# EAGLE board ADCS Motherboard (EAGLE 9.6.2)
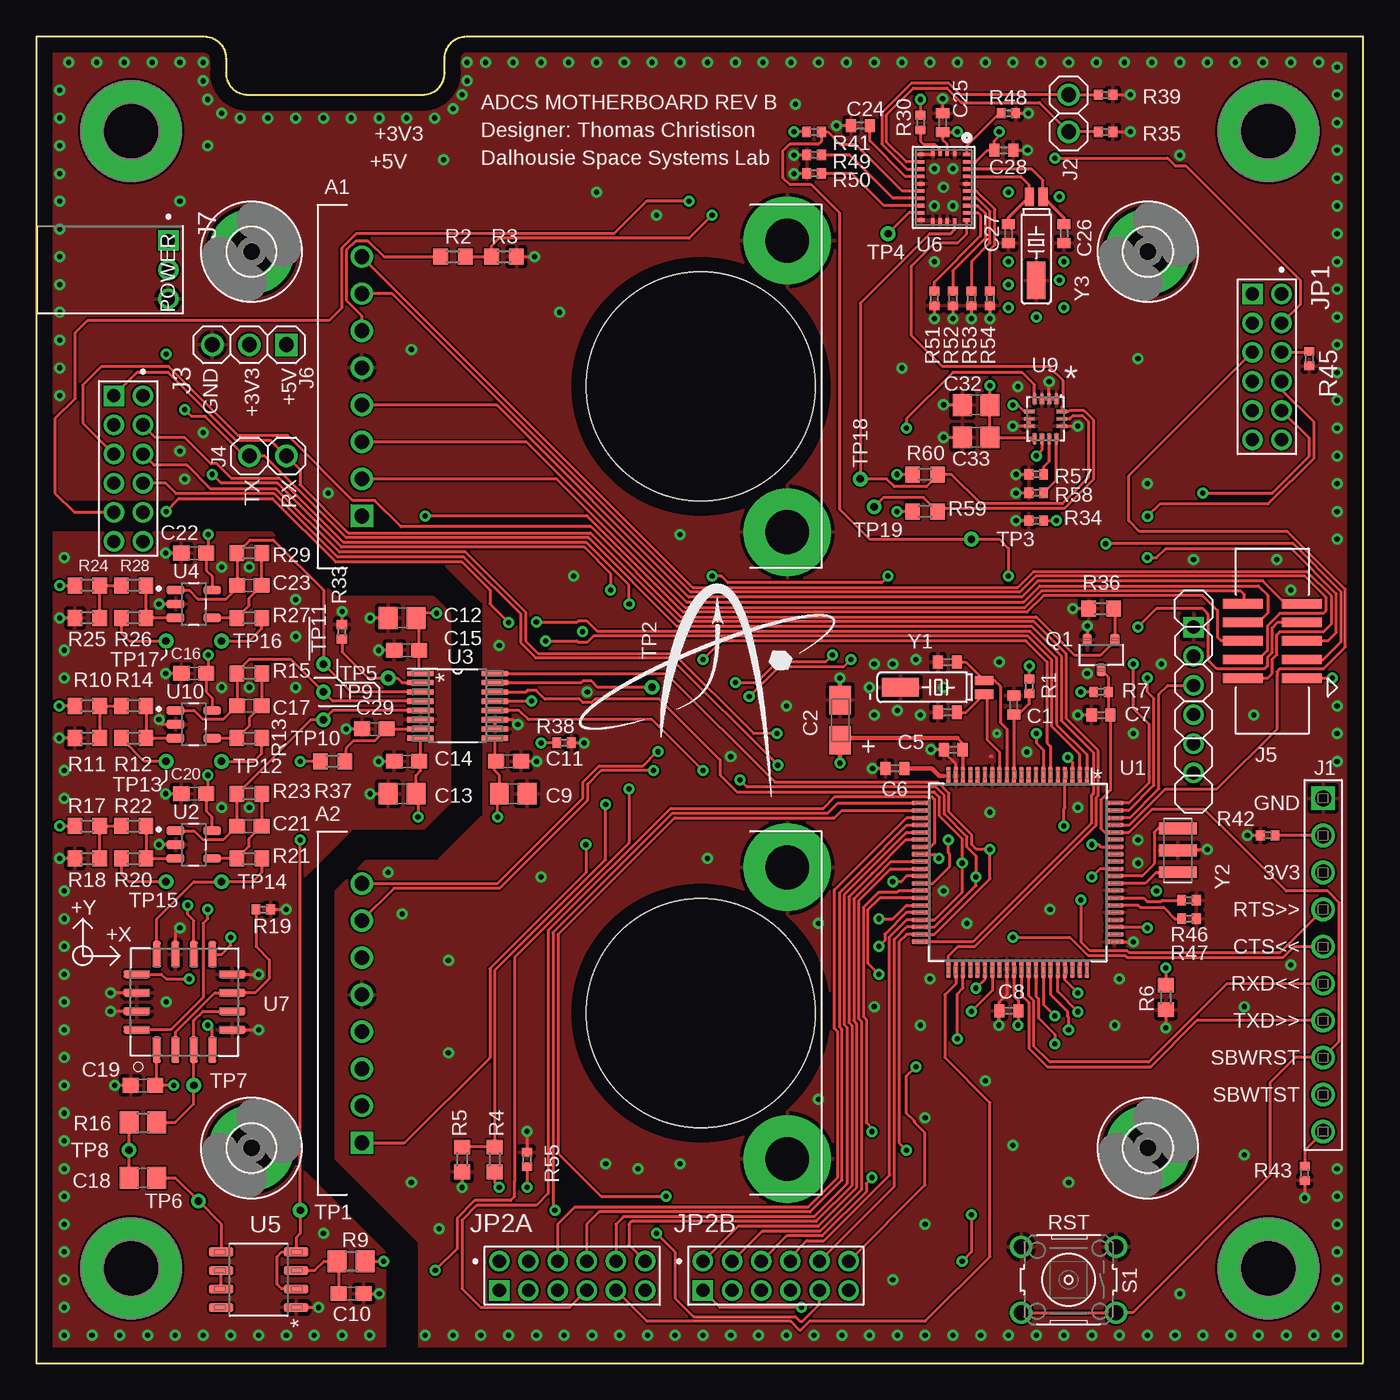
[diagram p4: board, top side]
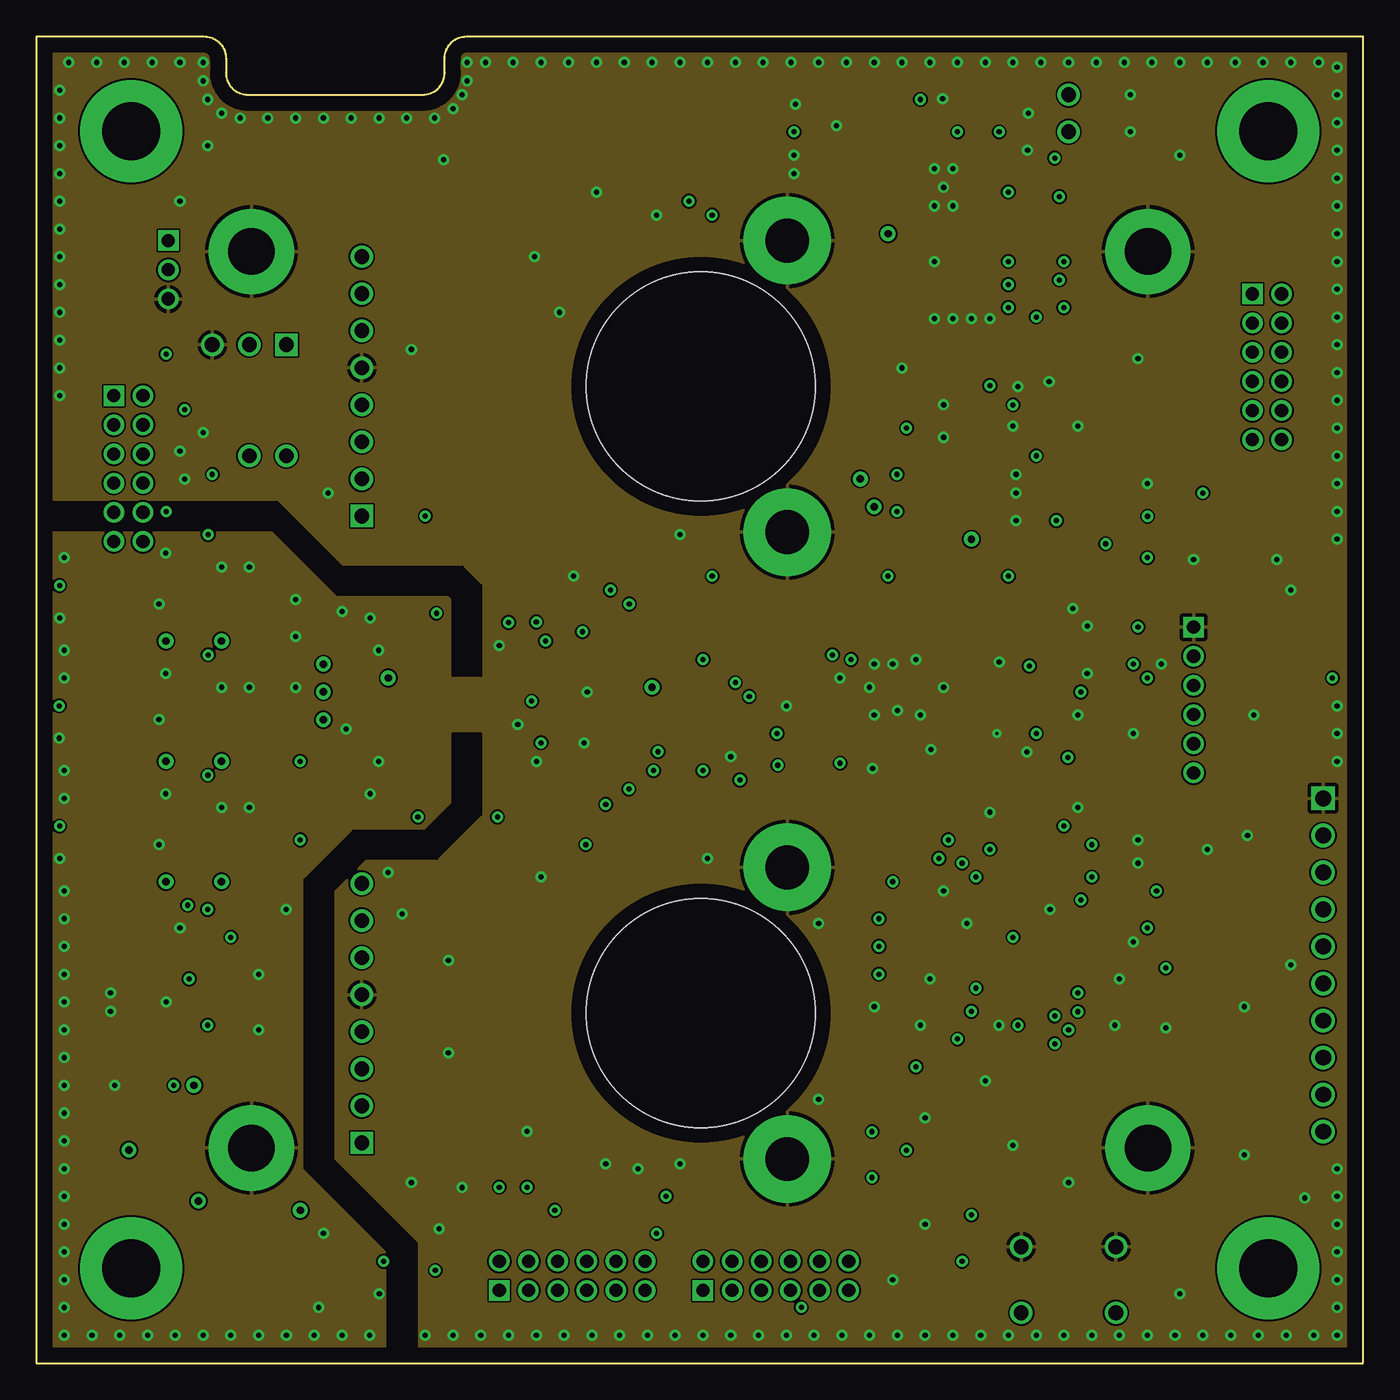
[diagram p5: board, inner layer GND]
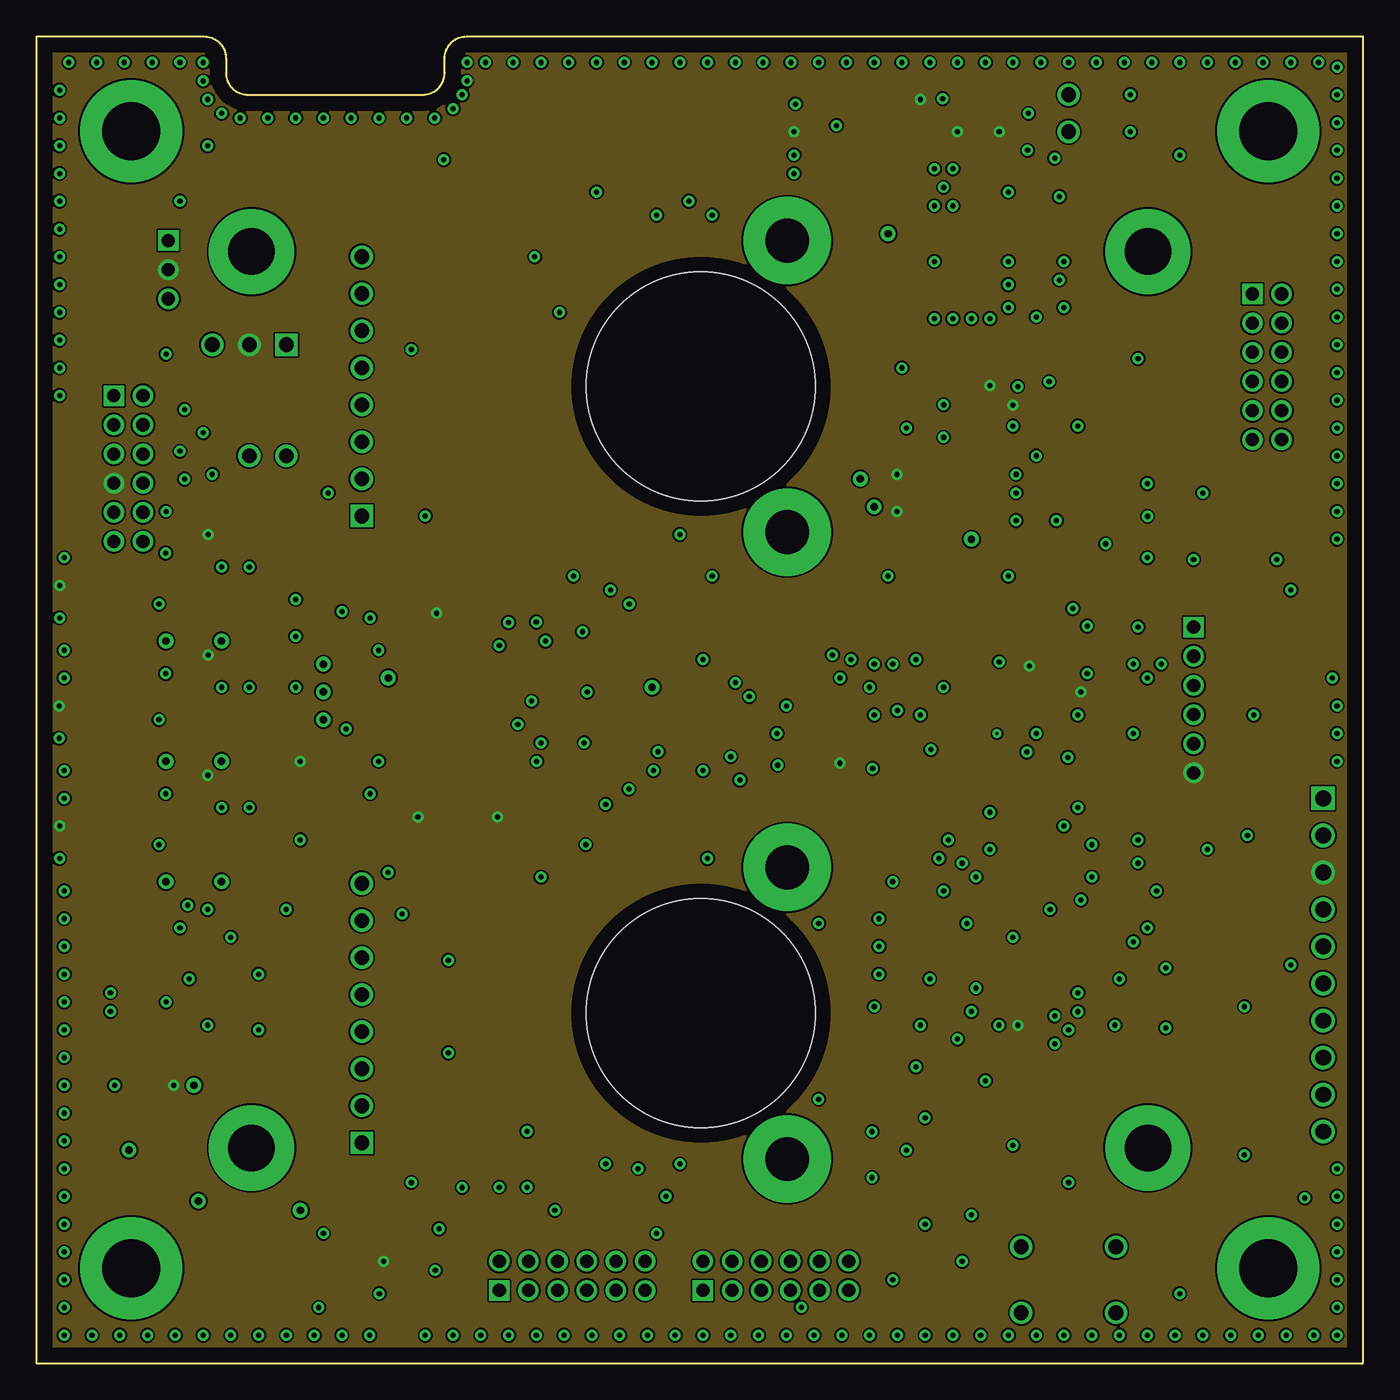
[diagram p6: board, inner layer PWR]
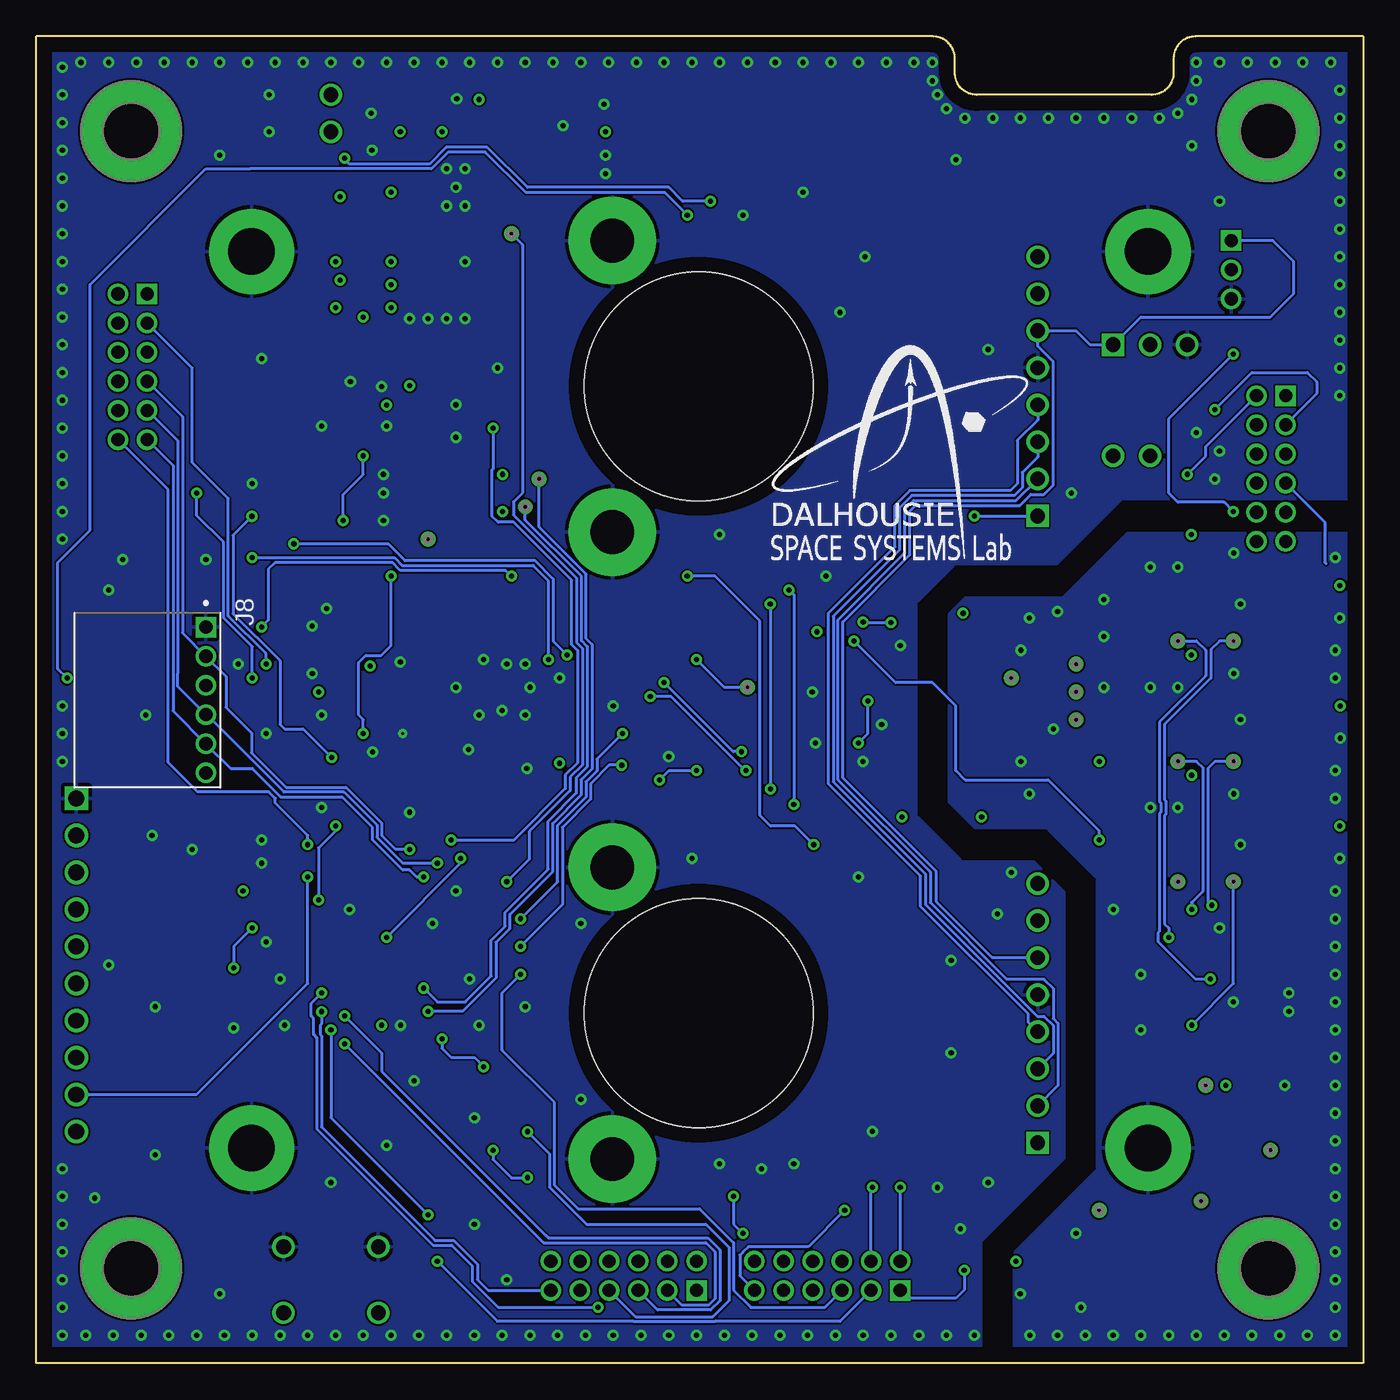
[diagram p7: board, bottom side, seen from below]

Size 91 x 91 mm. Coordinates in mm from the lower left corner, seen from the top.
Outline: 0,0 91,0 91,91 29.5,91 arc90 28,89.5 28,88.5 arc-90 26.5,87 14.5,87 arc-90 13,88.5 13,89.5 arc90 11.5,91 0,91 0,0
Copper layers (1+2*15+16): Top 0.035mm / dielectric 0.2mm / GND 0.035mm / dielectric 1.03mm / PWR 0.035mm / dielectric 0.2mm / Bottom 0.035mm
Design rules "default *": minimum track width 6mil, minimum drill 0.2mm, track to track 5mil, track to pad 0.2mm, pad to pad 5mil, via to via 0.54mm, smd to smd 6mil, copper to edge 40mil, drill to drill 0.54mm, minimum pad ring 10mil, minimum via ring 8mil, stop-mask expansion 4mil, vias tented up to drill 0mil, thermal gap 10mil
Net classes: 1 Ground: width 0.203 mm, drill 0.305 mm, clearance 0.152 mm to class 0, clearance 0.152 mm; 2 Power: width 0.203 mm, drill 0.305 mm, clearance 0.152 mm to class 0, clearance 0.152 mm to class 1, clearance 0.152 mm

## Footprints (pad centres in the part's own frame; a part is rotated, then mirrored left to right if it is on the bottom)
ARDUCAM = drill 1.016 square: 1 -29.18,-18.89 | drill 1.016: 2 -29.18,-16.35; 3 -29.18,-13.81; 4 -29.18,-11.27; 5 -29.18,-8.73; 6 -29.18,-6.19; 7 -29.18,-3.65; 8 -29.18,-1.11 | drill 3 pad 6: P$1 0,0; P$2 0,-20 | hole 15.7: -5.917,-10
C0402 = smd 0.7 x 0.9: 1 -0.65,0; 2 0.65,0
A/3216-18R = smd 1.95 x 1.5: + 1.375,0; - -1.375,0
C0805 = smd 1.3 x 1.5: 1 -0.95,0; 2 0.95,0
C0603 = smd 1.1 x 1: 1 -0.85,0; 2 0.85,0
3,2-PAD = drill 3.2 pad 5.842: B3,2 0,0
HDRV10W66P254_10X1_2540X254H858 = drill 1.08 pad 1.62 square: 1 0,0 | drill 1.08 pad 1.62: 2 2.54,0; 3 5.08,0; 4 7.62,0; 5 10.16,0; 6 12.7,0; 7 15.24,0; 8 17.78,0; 9 20.32,0; 10 22.86,0
1X02 = drill 1.016: 1 -1.27,0; 2 1.27,0
832-10-012-10-005000 = drill 0.9 pad 1.25 square: 1 0,-2 | drill 0.9 pad 1.25: 2 0,0; 3 2,-2; 4 2,0; 5 4,-2; 6 4,0; 7 6,-2; 8 6,0; 9 8,-2; 10 8,0; 11 10,-2; 12 10,0
CNC_3221-10-0300-00 = smd 0.65 x 2.76: 1 -2.54,-2.02; 2 -2.54,2.02; 3 -1.27,-2.02; 4 -1.27,2.02; 5 0,-2.02; 6 0,2.02; 7 1.27,-2.02; 8 1.27,2.02; 9 2.54,-2.02; 10 2.54,2.02
1X03 = drill 1.016 square: 1 -2.54,0 | drill 1.016: 2 0,0; 3 2.54,0
830-10-003-20-005000 = drill 0.9 pad 1.25 square: 1 0,0 | drill 0.9 pad 1.25: 2 2,0; 3 4,0
830-10-006-20-005000 = drill 0.9 pad 1.25 square: 1 0,0 | drill 0.9 pad 1.25: 2 2,0; 3 4,0; 4 6,0; 5 8,0; 6 10,0
MTGP700H400 = drill 4 pad 7: 1 0,0
SOT23-3P95_230X110L20X43N_PMV16XN = smd 0.61 x 0.87: 1 -0.95,-1.02; 2 0.95,-1.02; 3 0,1.02
R0402 = smd 0.6 x 0.7: 1 -0.5,0; 2 0.5,0
R0603 = smd 1 x 1.1: 1 -0.85,0; 2 0.85,0
R0805 = smd 1.3 x 1.5: 1 -0.95,0; 2 0.95,0
B3F-10XX = drill 1.016: 1 -3.251,2.261; 2 3.251,2.261; 3 -3.251,-2.261; 4 3.251,-2.261
TP_P76H50 = drill 0.51 pad 0.762: 1 0,0
QFP80P50_1400X1400X160L60X22N = smd 0.3 x 1.26: 1 -4.75,-6.63; 2 -4.25,-6.63; 3 -3.75,-6.63; 4 -3.25,-6.63; 5 -2.75,-6.63; 6 -2.25,-6.63; 7 -1.75,-6.63; 8 -1.25,-6.63; 9 -0.75,-6.63; 10 -0.25,-6.63; 11 0.25,-6.63; 12 0.75,-6.63; 13 1.25,-6.63; 14 1.75,-6.63; 15 2.25,-6.63; 16 2.75,-6.63; 17 3.25,-6.63; 18 3.75,-6.63; 19 4.25,-6.63; 20 4.75,-6.63; 41 4.75,6.63; 42 4.25,6.63; 43 3.75,6.63; 44 3.25,6.63; 45 2.75,6.63; 46 2.25,6.63; 47 1.75,6.63; 48 1.25,6.63; 49 0.75,6.63; 50 0.25,6.63; 51 -0.25,6.63; 52 -0.75,6.63; 53 -1.25,6.63; 54 -1.75,6.63; 55 -2.25,6.63; 56 -2.75,6.63; 57 -3.25,6.63; 58 -3.75,6.63; 59 -4.25,6.63; 60 -4.75,6.63 | smd 1.26 x 0.3: 21 6.63,-4.75; 22 6.63,-4.25; 23 6.63,-3.75; 24 6.63,-3.25; 25 6.63,-2.75; 26 6.63,-2.25; 27 6.63,-1.75; 28 6.63,-1.25; 29 6.63,-0.75; 30 6.63,-0.25; 31 6.63,0.25; 32 6.63,0.75; 33 6.63,1.25; 34 6.63,1.75; 35 6.63,2.25; 36 6.63,2.75; 37 6.63,3.25; 38 6.63,3.75; 39 6.63,4.25; 40 6.63,4.75; 61 -6.63,4.75; 62 -6.63,4.25; 63 -6.63,3.75; 64 -6.63,3.25; 65 -6.63,2.75; 66 -6.63,2.25; 67 -6.63,1.75; 68 -6.63,1.25; 69 -6.63,0.75; 70 -6.63,0.25; 71 -6.63,-0.25; 72 -6.63,-0.75; 73 -6.63,-1.25; 74 -6.63,-1.75; 75 -6.63,-2.25; 76 -6.63,-2.75; 77 -6.63,-3.25; 78 -6.63,-3.75; 79 -6.63,-4.25; 80 -6.63,-4.75
SOT95P280X145-5N = smd 1.21 x 0.59: 1 -1.255,0.95; 2 -1.255,0; 3 -1.255,-0.95; 4 1.255,-0.95; 5 1.255,0.95
DBQ16 = smd 1.803 x 0.356: 1 -2.553,2.223; 2 -2.553,1.587; 3 -2.553,0.953; 4 -2.553,0.318; 5 -2.553,-0.318; 6 -2.553,-0.953; 7 -2.553,-1.587; 8 -2.553,-2.223; 9 2.553,-2.223; 10 2.553,-1.587; 11 2.553,-0.953; 12 2.553,-0.318; 13 2.553,0.318; 14 2.553,0.953; 15 2.553,1.587; 16 2.553,2.223
SOIC8P127_490X600X175L72X40N_DMC4050SSDQ-13 = smd 0.65 x 1.68: 1 -1.905,-2.575; 2 -0.635,-2.575; 3 0.635,-2.575; 4 1.905,-2.575; 5 1.905,2.575; 6 0.635,2.575; 7 -0.635,2.575; 8 -1.905,2.575
BNO055 = smd 0.25 x 0.475: 1 -2.25,1.562; 6 -2.25,-1.562; 7 -1.75,-1.562; 8 -1.25,-1.562; 9 -0.75,-1.562; 10 -0.25,-1.562; 11 0.25,-1.562; 12 0.75,-1.562; 13 1.25,-1.562; 14 1.75,-1.562; 15 2.25,-1.562; 20 2.25,1.562; 21 1.75,1.562; 22 1.25,1.562; 23 0.75,1.562; 24 0.25,1.562; 25 -0.25,1.562; 26 -0.75,1.562; 27 -1.25,1.562; 28 -1.75,1.562 | smd 0.375 x 0.25: 2 -2.312,0.75; 3 -2.312,0.25; 4 -2.312,-0.25; 5 -2.312,-0.75; 16 2.312,-0.75; 17 2.312,-0.25; 18 2.312,0.25; 19 2.312,0.75
LCCS16P127_736X736X279L127X50N = smd 0.56 x 1.83: 1 -1.905,-3.275; 2 -0.635,-3.275; 3 0.635,-3.275; 4 1.905,-3.275; 9 1.905,3.275; 10 0.635,3.275; 11 -0.635,3.275; 12 -1.905,3.275 | smd 1.83 x 0.56: 5 3.275,-1.905; 6 3.275,-0.635; 7 3.275,0.635; 8 3.275,1.905; 13 -3.275,1.905; 14 -3.275,0.635; 15 -3.275,-0.635; 16 -3.275,-1.905
QFN14P50_300X250X100L47X25N = smd 0.79 x 0.27: 1 -1.365,0.75; 2 -1.365,0.25; 3 -1.365,-0.25; 4 -1.365,-0.75; 8 1.365,-0.75; 9 1.365,-0.25; 10 1.365,0.25; 11 1.365,0.75 | smd 0.27 x 0.79: 5 -0.5,-1.115; 6 0,-1.115; 7 0.5,-1.115; 12 0.5,1.115; 13 0,1.115; 14 -0.5,1.115
MS3V-T1R = smd 0.635 x 1.27: P1 -0.47,-4.43; P2 0.47,-4.43 | smd 1.27 x 2.54: P3 0,1.3
MURATA-FILTER_CSTCR = smd 0.8 x 2.6: 1 -1.5,0; 2 0,0; 3 1.5,0

## Placement (x,y rotation side)
A1  ARDUCAM_OV5642  [ARDUCAM]  51.5,77 0 top
A2  ARDUCAM_OV5642  [ARDUCAM]  51.5,34 0 top
C1  100n  [C0402]  67.04,45.14 90 top
C2  10u  [A/3216-18R]  55.13,44.09 270 top
C3  12p  [C0402]  62.5,48.08 0 top
C4  12p  [C0402]  62.5,44.64 0 top
C5  100n  [C0402]  62.89,42.08 0 top
C6  470n  [C0402]  58.89,40.79 0 top
C7  1n  [C0402]  73.03,44.45 180 top
C8  100n  [C0402]  66.71,24.17 180 top
C9  1u  [C0805]  32.7,39.05 0 top
C10  1u  [C0603]  21.59,4.76 180 top
C11  0.1u  [C0603]  32.38,41.27 0 top
C12  1u  [C0805]  25.08,51.12 180 top
C13  1u  [C0805]  25.08,39.05 180 top
C14  0.1u  [C0603]  25.4,41.27 180 top
C15  0.1u  [C0603]  25.4,48.9 180 top
C16  0.1u  [C0603]  10.79,47.31 180 top
C17  1n  [C0603]  14.61,45.09 180 top
C18  0.1u  [C0805]  7.3,12.7 180 top
C19  0.1u  [C0603]  7.3,19.05 180 top
C20  0.1u  [C0603]  10.79,39.05 180 top
C21  1n  [C0603]  14.61,36.83 180 top
C22  0.1u  [C0603]  10.79,55.56 180 top
C23  1n  [C0603]  14.61,53.34 180 top
C24  1u  [C0402]  56.52,84.89 0 top
C25  0.1u  [C0402]  62.16,85.09 270 top
C26  22p  [C0402]  70.48,77.47 90 top
C27  22p  [C0402]  66.67,77.47 90 top
C28  0.1u  [C0402]  66.36,83.19 180 top
C29  0.1u  [C0603]  23.18,43.5 180 top
C32  0.1uF  [C0805]  64.45,65.72 180 top
C33  0.1uF  [C0805]  64.45,63.5 180 top
H1  MOUNT-PAD-ROUND3.2  [3,2-PAD]  14.75,76.25 0 top
H2  MOUNT-PAD-ROUND3.2  [3,2-PAD]  76.25,76.25 0 top
H3  MOUNT-PAD-ROUND3.2  [3,2-PAD]  76.25,14.75 0 top
H4  MOUNT-PAD-ROUND3.2  [3,2-PAD]  14.75,14.75 0 top
J1  HDR_10_EZFET_DEBUGGER  [HDRV10W66P254_10X1_2540X254H858]  88.27,38.73 270 top
J2  [1X02]  70.8,85.72 90 top
J3  832-10-012-10-005000  [832-10-012-10-005000]  7.3,66.36 270 top
J4  [1X02]  15.88,62.23 0 top
J5  CNC_3221-10-0300-00  [CNC_3221-10-0300-00]  84.77,49.53 90 top
J6  [1X03]  14.61,69.85 180 top
J7  830-10-003-20-005000  [830-10-003-20-005000]  9.05,76.99 270 top
J8  830-10-006-20-005000  [830-10-006-20-005000]  79.38,50.48 270 bottom
JP1  832-10-012-10-005000  [832-10-012-10-005000]  85.41,73.34 270 top
JP2A  832-10-012-10-005000  [832-10-012-10-005000]  31.75,6.99 0 top
JP2B  832-10-012-10-005000  [832-10-012-10-005000]  45.72,6.99 0 top
MH1  MTGP700H400  [MTGP700H400]  6.5,6.5 0 top
MH2  MTGP700H400  [MTGP700H400]  84.5,6.5 0 top
MH3  MTGP700H400  [MTGP700H400]  84.5,84.5 0 top
MH4  MTGP700H400  [MTGP700H400]  6.5,84.5 0 top
Q1  BSR802NL6327HTSA1  [SOT23-3P95_230X110L20X43N_PMV16XN]  73.03,48.58 180 top
R1  0R  [R0402]  68.11,46.43 90 top
R2  1k  [R0603]  28.57,75.88 180 top
R3  2k  [R0603]  32.07,75.88 180 top
R4  1k  [R0603]  31.43,13.97 270 top
R5  2k  [R0603]  29.21,13.97 90 top
R6  1M  [R0603]  77.47,25.08 90 top
R7  47k  [R0402]  73.03,46.04 180 top
R9  200R  [R0805]  21.59,6.99 0 top
R10  1k  [R0603]  3.49,45.09 0 top
R11  1k  [R0603]  3.49,42.86 180 top
R12  5.6k  [R0603]  6.67,42.86 180 top
R13  5.6k  [R0603]  14.61,42.86 0 top
R14  1.37M  [R0603]  6.67,45.09 0 top
R15  1.37M  [R0603]  14.61,47.31 0 top
R16  1R  [R0805]  7.3,16.51 0 top
R17  1k  [R0603]  3.49,36.83 0 top
R18  1k  [R0603]  3.49,34.61 180 top
R19  5.1M  [R0402]  15.56,31.11 180 top
R20  5.6k  [R0603]  6.67,34.61 180 top
R21  5.6k  [R0603]  14.61,34.61 0 top
R22  1.37M  [R0603]  6.67,36.83 0 top
R23  1.37M  [R0603]  14.61,39.05 0 top
R24  1k  [R0603]  3.49,53.34 0 top
R25  1k  [R0603]  3.49,51.12 180 top
R26  5.6k  [R0603]  6.67,51.12 180 top
R27  5.6k  [R0603]  14.61,51.12 0 top
R28  1.37M  [R0603]  6.67,53.34 0 top
R29  1.37M  [R0603]  14.61,55.56 0 top
R30  10k  [R0402]  60.64,85.09 90 top
R33  5.1M  [R0402]  20.95,50.16 270 top
R34  5.1M  [R0402]  68.58,57.78 0 top
R35  5.1M  [R0402]  73.34,84.45 180 top
R36  10k  [R0603]  73.03,51.75 0 top
R37  10k  [R0603]  20.32,41.27 0 top
R38  5.1M  [R0402]  36.2,42.55 180 top
R39  5.1M  [R0402]  73.34,87 180 top
R41  10k  [R0402]  53.34,84.45 180 top
R42  5.1M  [R0402]  84.45,36.2 180 top
R43  5.1M  [R0402]  87,13.02 270 top
R45  5.1M  [R0402]  87.31,68.9 270 top
R46  5.1M  [R0402]  79.06,31.75 0 top
R47  5.1M  [R0402]  79.06,30.48 0 top
R48  5.1M  [R0402]  66.67,85.72 180 top
R49  5.1M  [R0402]  53.34,82.87 0 top
R50  5.1M  [R0402]  53.34,81.6 0 top
R51  5.1M  [R0402]  61.59,73.03 90 top
R52  5.1M  [R0402]  62.87,73.03 90 top
R53  5.1M  [R0402]  64.14,73.03 90 top
R54  5.1M  [R0402]  65.41,73.03 90 top
R55  5.1M  [R0402]  33.66,13.97 270 top
R57  5.1M  [R0402]  68.58,60.96 180 top
R58  5.1M  [R0402]  68.58,59.69 180 top
R59  4.7k  [R0603]  60.96,58.42 180 top
R60  4.7k  [R0603]  60.96,60.96 180 top
S1  RST  [B3F-10XX]  70.8,5.71 180 top
TP1  TESTPOINT  [TP_P76H50]  18.1,10.48 90 top
TP2  TESTPOINT  [TP_P76H50]  42.23,46.35 270 top
TP3  TESTPOINT  [TP_P76H50]  64.14,56.52 180 top
TP4  TESTPOINT  [TP_P76H50]  58.42,77.47 90 top
TP5  TESTPOINT  [TP_P76H50]  24.13,46.99 0 top
TP6  TESTPOINT  [TP_P76H50]  11.11,11.11 0 top
TP7  TESTPOINT  [TP_P76H50]  10.79,19.05 0 top
TP8  TESTPOINT  [TP_P76H50]  6.35,14.61 0 top
TP9  TESTPOINT  [TP_P76H50]  19.68,46.04 0 top
TP10  TESTPOINT  [TP_P76H50]  19.68,44.13 0 top
TP11  TESTPOINT  [TP_P76H50]  19.68,47.94 0 top
TP12  TESTPOINT  [TP_P76H50]  12.7,41.27 270 top
TP13  TESTPOINT  [TP_P76H50]  8.89,41.27 270 top
TP14  TESTPOINT  [TP_P76H50]  12.7,33.02 0 top
TP15  TESTPOINT  [TP_P76H50]  8.89,33.02 0 top
TP16  TESTPOINT  [TP_P76H50]  12.7,49.53 0 top
TP17  TESTPOINT  [TP_P76H50]  8.89,49.53 0 top
TP18  TESTPOINT  [TP_P76H50]  56.52,60.64 0 top
TP19  TESTPOINT  [TP_P76H50]  57.47,58.74 0 top
U1  MSP430F5529IPN  [QFP80P50_1400X1400X160L60X22N]  67.31,33.66 180 top
U2  TSV991AILT  [SOT95P280X145-5N]  10.79,35.56 0 top
U3  ADS7841E_2K5  [DBQ16]  28.89,45.09 0 top
U4  TSV991AILT  [SOT95P280X145-5N]  10.79,52.07 0 top
U5  DMC4050SSDQ-13  [SOIC8P127_490X600X175L72X40N_DMC4050SSDQ-13]  15.24,5.71 90 top
U6  BNO055  [BNO055]  62.23,80.64 270 top
U7  HMC1053  [LCCS16P127_736X736X279L127X50N]  10.16,24.77 0 top
U9  BMX160  [QFN14P50_300X250X100L47X25N]  69.22,64.77 270 top
U10  TSV991AILT  [SOT95P280X145-5N]  10.79,43.81 0 top
Y1  32.768kHz  [MS3V-T1R]  60.58,46.35 90 top
Y2  CSTCR4M00G15L99  [MURATA-FILTER_CSTCR]  78.3,35.17 270 top
Y3  32.768kHz  [MS3V-T1R]  68.58,75.56 180 top

## Tracks (layer width: path | path; a pad name or v marks a point on that pad's centre or on a via)
!CS!_CURR_SENSE_MTQR  (via drill 0.35)
  Top 0.203: v71.44,24.1 70.06,25.48 U1.56
  Bottom 0.203: v71.44,24.1 71.44,23.26 71.54,23.16 71.54,22.56 71.44,22.46 71.44,16.19 63.66,8.41 62.38,8.41 60.75,6.78 60.75,5.71 60.22,5.18 60.02,4.98 58.43,4.98 58.43,4.99 JP2B.11
!CS!_CURR_SENSE_RW  (via drill 0.35)
  Top 0.203: v71.44,25.4 70.56,26.28 U1.57 | v52.47,3.82 46.89,3.82 JP2B.1
  Bottom 0.203: v71.44,25.4 72.17,24.67 72.17,23.8 71.99,23.62 71.99,22.54 71.77,22.32 71.77,16.06 63.8,8.08 62.55,8.08 62.52,8.08 61.08,6.65 61.08,5.58 59.32,3.82 v52.47,3.82
!CS!_HMC1053  (via drill 0.35)
  Top 0.203: v45.72,48.26 46.99,49.53 67.89,49.53 69.31,48.1 69.31,42.55 69.56,42.3 U1.6 | U3.15 37.38,46.67 37.48,46.77 38.09,46.77 38.5,46.35 TP2.1
  Bottom 0.203: v45.72,48.26 43.81,46.35 TP2.1
!CS!_SPD_SENSE_RW  (via drill 0.35)
  Top 0.203: U1.43 63.56,25.72 63.18,25.34 v63.18,22.23 | v60.33,20.32 59.69,19.68 59.69,17.14 60.23,16.61 60.23,16.52 60.96,15.79 60.96,12.22 JP2B.12
  Bottom 0.203: v63.18,22.23 63.18,21.59 62.55,20.95 60.96,20.95 v60.33,20.32
!CS!_SUN_X+  (via drill 0.35)
  Top 0.203: U1.74 73.03,35.41 72.87,35.56 v72.39,35.56
  Bottom 0.203: v72.39,35.56 72.39,36.2 74.61,38.42 74.61,38.73 75.06,39.19 77.47,39.19 79.95,39.19 81.97,41.2 81.97,59.9 JP1.12
!CS!_SUN_X-
  Top 0.203: U1.77 74.96,36.91 77.43,39.37 80.96,39.37 85.1,43.51 85.1,47.17 85.1,47.31 85.1,47.43 85.3,47.63 88.3,47.63 89.8,49.13 89.8,53.07 85.81,57.05 75.66,57.05 74.93,57.78 74.93,60.87 JP1.5
!CS!_SUN_Y+  (via drill 0.35)
  Top 0.203: U1.79 74.93,37.91 76.66,39.64 76.66,45.57 76.2,46.04 v76.2,46.99 | v80.01,59.69 84.77,59.69 87.31,62.23 87.31,63.44 JP1.10
  Bottom 0.203: v76.2,46.99 76.2,49.15 78.17,51.12 78.17,56.31 80.01,58.15 v80.01,59.69
!CS!_SUN_Y-  (via drill 0.35)
  Top 0.203: U1.80 74.92,38.41 76.33,39.82 76.33,43.81 75.25,44.9 v75.25,47.94
  Bottom 0.203: v75.25,47.94 75.25,48.66 77.84,51.26 77.84,59.3 80.31,61.78 80.31,68.25 JP1.3
!CS!_SUN_Z+
  Top 0.203: U1.78 75,37.41 76.99,39.4 76.99,45.88 77.6,46.48 J8.3
!CS!_SUN_Z-  (via drill 0.35)
  Top 0.203: v70.75,41.54 71.06,41.22 U1.3 | JP1.8 85.41,66.77 87.64,64.53 87.64,62.09 84.51,58.96 77.09,58.96 v76.22,58.08
  Bottom 0.203: v70.75,41.54 72.71,43.5 73.98,43.5 74.3,43.81 74.3,48.17 77.51,51.39 77.51,56.79 v76.22,58.08
+3V3  (via drill 0.35)
  Top 0.203: v1.59,36.83 R17.1 | v1.59,53.34 R24.1 | U3.8 26.34,41.37 C14.1 26.35,41.17 26.35,40.64 26.03,40.32 C13.1 26.16,38.92 v26.16,37.47 | R9.2 v23.81,6.99 | R1.2 v68.11,47.81 | U3.1 26.25,47.4 C15.1 26.25,50.9 C12.1 26.35,51.44 v27.43,51.44 | C2.+ 55.13,42.6 | v11.77,56.83 11.77,55.69 C22.1 11.64,54.38 12.05,53.98 U4.5 | U3.9 31.45,41.37 C11.1 31.43,41.17 31.43,40.64 31.75,40.32 C9.1 31.62,38.92 v31.62,37.47 | v11.76,40.32 11.76,39.17 C20.1 | C20.1 11.71,38.99 | U6.3 62.48,83.59 62.16,83.91 C25.2 v63.18,84.44 v63.18,84.45 | U6.28 64.45,82.39 65.24,83.19 C28.2 65.71,83.85 66.04,84.18 v66.04,84.45 | v9.43,19.05 v9.42,19.05 C19.1 8.26,19.15 U7.1 | U1.50 67.06,25.15 67.36,24.84 C8.1 67.36,23.2 v67.33,23.18 | R41.2 v51.96,84.45 | v60.64,86.68 R30.2 | R37.1 v18.09,41.27 | U9.8 68.37,63.5 C33.1 C32.1 65.4,66.99 v65.41,67.06 | R60.2 v59.03,60.96 | R59.2 v59.03,58.42 | v11.77,48.58 11.77,47.44 C16.1 11.64,46.04 12.05,45.63 U10.5 | U2.5 12.05,37.47 11.64,37.87 C20.1 | R10.1 v1.56,45.09 | R7.2 v71.64,46.04 | U9.5 67.76,65.27 67.31,65.72 v66.99,65.72 | 63.17,42.88 63.56,42.48 63.56,42.06
  Top 0.254: 63.56,42.01 U1.18
  Top 0.305: 63.56,42.06 C5.2 63.56,42.01 | 55.13,42.6 v55.13,41.15 | 63.17,42.88 55.29,42.88 C2.+
  Bottom 0.203: 2.54,54.84 2.64,54.94 2.64,57.69 J3.7
  pour PWR (rank 6, no thermals): -4.45,93.98 -4.45,-3.81 95.25,-3.81 95.25,92.71 95.25,93.98
+5V
  Top 0.203: A1.6 22.32,71.85 21.26,72.91 21.26,76.33 21.88,76.95 22.76,76.95 23.83,75.88 R2.2
  Bottom 0.203: A2.6 22.34,27.83 25.46,27.83 29.29,31.67 29.29,33.75 35.68,40.14 35.68,50.84 31.11,55.41 31.11,58.42 30.7,58.84 23.54,58.84 22.79,59.59 21.88,59.59 21.26,60.21 21.26,68.71 22.32,69.77 A1.6 19.69,70.81 18.73,69.85 J6.1 15.24,71.75 6.35,71.75 4.76,73.34 4.76,75.56 6.19,76.99 J7.1
ACT_BRD_3V_PRESENT  (via drill 0.35)
  Top 0.203: v40.64,39.37 40.64,35.67 32.8,27.83 32.8,12.49 32.81,12.48 32.81,11.43 32.53,11.15 30.07,11.15 28.85,9.94 28.85,7.84 v27.36,6.35 | v40.67,52.07 40.64,52.07 40.64,53.37 37.72,56.29 21.06,56.29 16.67,60.68 13.38,60.68 12.37,61.69 11.97,61.69 10.16,63.5 8.16,63.5 J3.4
  Bottom 0.203: v40.67,52.07 40.64,52.04 v40.64,39.37 | v27.36,6.35 27.36,5.03 27.94,4.45 31.21,4.45 JP2A.1
ACT_BRD_5V_PRESENT  (via drill 0.35)
  Top 0.203: R4.2 31.43,12.38 v31.75,12.06
  Bottom 0.203: JP2A.2 v31.75,12.06
ACT_BRD_5V_SHIFTED  (via drill 0.35)
  Top 0.203: R5.2 R4.1 31.43,26.93 39.05,34.55 v39.05,38.32 | v39.37,53.02 39.37,54.17 37.58,55.96 20.92,55.96 16.53,60.35 12.68,60.35 v12.06,60.96
  Bottom 0.203: v39.37,53.02 39.05,52.7 v39.05,38.32 | v12.06,60.96 10.79,62.23 10.79,62.87 J3.2
AVCC1
  Top 0.203: R1.1 68.12,45.77 68.12,45.24 67.37,44.49 C1.1 67.04,40.3 U1.11
B_MEAS_X
  Top 0.203: U3.5 20.32,44.77 TP10.1 18.84,44.13 R23.1 C21.2 12.84,35.91 11.41,35.91 10.81,36.51 U2.1
B_MEAS_Y
  Top 0.203: U3.4 20.32,45.4 TP9.1 17.46,48.26 14.61,48.26 13.76,47.41 R15.1 C17.2 12.84,44.17 11.41,44.17 10.96,44.62 10.81,44.77 U10.1
B_MEAS_Z
  Top 0.203: U3.3 21.59,46.04 TP11.1 19.68,53.02 16.24,56.46 14.66,56.46 R29.1 C23.2 13.76,53.17 13.01,52.42 11.08,52.42 10.48,53.02 U4.1
BMX160_INT1  (via drill 0.35)
  Top 0.203: v62.55,35.88 62.55,35.01 62.65,34.91 62.65,34.07 61.48,32.91 U1.32 | U9.4 68.47,67.11 67.63,67.94 62.87,67.94 59.69,64.77 v59.69,64.14
  Bottom 0.203: v59.69,64.14 59.69,61.34 59.76,61.26 59.76,58.12 59.33,57.69 58.26,57.69 54.28,53.71 54.28,49.28 53.88,48.88 53.88,41.17 54.73,40.32 54.73,39.4 58.25,35.88 v62.55,35.88
BMX160_INT2  (via drill 0.35)
  Top 0.203: R34.2 v69.96,57.78 | U9.9 68.97,62.62 v68.58,62.23
  Bottom 0.203: v69.96,57.78 69.96,59.58 68.58,60.96 v68.58,62.23
BNO055_INT  (via drill 0.35)
  Top 0.203: U6.14 59.84,78.89 TP4.1 | U1.31 59.69,33.41 59.3,33.02 v58.74,33.02
  Bottom 0.203: v58.74,33.02 57.16,34.59 57.16,36.5 54.4,39.27 54.4,40.19 53.55,41.04 53.55,49.02 53.95,49.42 53.95,53.85 58.28,58.17 58.28,59.07 57.66,59.69 57.66,76.71 TP4.1
BNO055_RST  (via drill 0.35)
  Top 0.203: U6.11 59.4,80.39 56.22,83.57 55.16,83.57 54.28,84.45 R41.1 53.84,83.82 53.62,83.6 51.66,83.6 51.23,83.17 51.23,81.29 51.66,80.86 53.12,80.86 55.07,78.92 55.07,58.6 57.15,56.52 TP3.1 66.04,56.52 66.67,55.88 v66.67,53.98 | v68.58,43.18 68.58,42.55 69.06,42.06 U1.7
  Bottom 0.203: v68.58,43.18 68.58,44.13 68.9,44.45 68.9,48.06 68.41,48.55 67.34,48.55 66.67,49.21 v66.67,53.98
CAM_5V_PRESENT  (via drill 0.35)
  Top 0.203: R2.1 R3.2 31.22,76.62 31.75,77.15 44.77,77.15 v46.35,78.74 | J5.1 v88.9,46.99
  Bottom 0.203: v88.9,46.99 89.53,47.62 89.53,54.93 87.31,57.15 87.31,73.98 79.38,81.92 76.34,81.92 63.9,81.92 62.75,83.07 60.21,83.07 57.44,80.3 47.92,80.3 v46.35,78.74
CAMERA-1_CS  (via drill 0.35)
  Top 0.203: v26.67,58.1 37.77,58.1 44.36,51.51 67.95,51.51 69.09,52.65 79.99,52.65 81.02,51.63 81.02,49.79 81.28,49.53 J5.6
  Bottom 0.203: v26.67,58.1 v26.66,58.11 A1.1
CAMERA-1_SCL
  Top 0.203: A1.8 45.01,53.2 67.31,53.2 68.41,54.3 87.16,54.3 88.8,52.66 88.8,50.68 88.3,50.17 88.28,50.17 88.27,50.16 85.29,50.16 85.11,49.98 85.09,49.96 85.09,48.6 84.77,48.28 84.77,47.31 84.45,46.99 J5.2
CAMERA-1_SDA
  Top 0.203: A1.7 23.5,73.35 23.5,73.34 24.4,73.34 44.87,52.88 67.45,52.88 68.55,53.98 87.02,53.98 88.47,52.52 88.47,51.62 88.28,51.43 85.29,51.43 84.43,50.57 84.43,48.87 83.82,48.26 J5.4
CAMERA-2_CS  (via drill 0.35)
  Top 0.203: A2.1 25.27,15.11 31.1,20.94 31.1,27.06 37.68,33.64 v37.68,35.56 | v46.35,53.98 46.99,53.98 47.43,53.53 57.98,53.53 v58.42,53.98 | J5.7 85.13,50.8 84.76,50.44 84.76,48.74 84.43,48.41 84.43,47.81 84.25,47.62 80.96,47.62 80.38,48.21 80.38,51.31 80.33,51.37 80.33,51.44 80.01,51.75 76.83,51.75 v75.56,50.48
  Bottom 0.203: v46.35,53.98 44.45,53.98 41.37,50.9 41.37,37.56 40.64,36.83 38.95,36.83 v37.68,35.56 | v75.56,50.48 75.09,50.96 75.09,54.45 74.62,54.91 66.58,54.91 66.04,54.38 58.82,54.38 v58.42,53.98
CAMERA-2_SCL  (via drill 0.35)
  Top 0.203: A2.8 31.62,32.89 37.47,38.73 37.47,39.84 38.6,40.97 41.62,40.97 42.59,41.94 v42.64,41.94 | v47.94,46.67 49.38,46.67 50.82,48.11 54.15,48.11 v54.61,48.58 | J5.3 88.27,48.26 89.47,49.46 89.47,52.93 86.2,56.2 v73.34,56.2
  Bottom 0.203: v42.64,41.94 43.21,41.94 v47.94,46.67 | v54.61,48.58 55.55,49.52 55.55,53.79 56.8,55.04 65.72,55.04 66.88,56.2 v73.34,56.2
CAMERA-2_SDA  (via drill 0.35)
  Top 0.203: v55.88,48.26 55.4,47.78 50.96,47.78 v48.9,45.72 | v42.33,40.64 38.73,40.64 37.8,39.7 37.8,38.6 31.76,32.56 24.53,32.56 A2.7 | J5.5 88.58,49.53 89.14,50.08 89.14,52.79 86.06,55.87 77.46,55.87 76.83,55.24 v76.2,55.24
  Bottom 0.203: v55.88,48.26 55.88,53.66 56.93,54.71 65.9,54.71 66.44,55.24 v76.2,55.24 | v42.33,40.64 42.38,40.64 47.47,45.72 v48.9,45.72
CAMERA_MISO
  Top 0.203: A1.3 33.62,63.19 44.59,52.22 67.72,52.22 68.82,53.31 83.82,53.31 84.45,52.68 84.45,51.44 83.82,50.8 J5.8
  Bottom 0.203: A2.3 21.26,21.25 21.26,23.17 21.88,23.79 22.36,23.79 30.02,31.45 30.02,33.53 36.34,39.86 36.34,51.24 31.77,55.81 31.77,58.69 30.95,59.52 23.91,59.52 23.38,60.05 23.38,61.09 22.32,62.15 A1.3
CAMERA_MOSI
  Top 0.203: A1.2 35.69,60.65 44.5,51.84 67.81,51.84 68.96,52.98 82.59,52.98 82.87,52.7 82.87,52.19 J5.10
  Bottom 0.203: A2.2 20.93,19.04 20.93,23.31 21.26,23.64 21.26,25.71 21.88,26.33 24.43,26.33 29.69,31.59 29.69,33.67 36.02,40 36.02,50.98 31.45,55.55 31.45,58.56 30.84,59.17 23.8,59.17 A1.2
CAMERA_SCLK
  Top 0.203: A1.4 31.55,65.73 44.73,52.55 67.58,52.55 68.68,53.65 84.14,53.65 85.71,52.07 J5.9
  Bottom 0.203: A2.4 22.97,23.38 22.97,23.94 30.35,31.32 30.35,33.4 36.67,39.73 36.67,51.44 32.11,56 32.11,58.83 31.08,59.85 24.19,59.85 23.71,60.33 23.71,63.3 22.32,64.69 A1.4
GND  (via drill 0.2, 0.35)
  Top 0.203: C20.2 v8.86,39.05 | R18.2 v1.59,34.61 | C22.2 v8.86,55.56 | R25.2 v1.59,51.12 | U1.19 63.06,41.08 62.24,41.9 C5.1 | C14.2 v23.47,41.27 | v34.32,41.27 C11.2 | C15.2 v23.47,48.9 | C13.2 23.52,39.05 v22.89,39.05 | C12.2 v22.89,51.12 | U1.61 75.23,28.91 v75.25,28.89 | C19.2 v5.37,19.05 | C10.1 v23.52,4.76 | R19.1 v17.14,31.11 | C6.1 v57.36,40.79 | U3.10 U3.11 32.7,44.13 v33.02,43.81 | R3.1 v34.18,75.88 | 65.56,41.59 65.41,41.59 | R36.1 v71.09,51.75 | v72.08,50.56 Q1.2 | R5.1 v29.21,12.04 | C24.1 v54.88,84.89 | v62.16,86.72 C25.1 | C28.1 v67.99,83.19 | R51.1 v61.59,71.64 | R52.1 v62.87,71.64 | R53.1 v64.14,71.64 | R54.1 v65.41,71.64 | R50.1 v51.96,81.6 | R48.1 v68.06,85.72 | v37.58,42.55 R38.1 | R43.2 v87,11.32 | U1.49 66.56,25.26 66.06,24.77 C8.2 66.02,24.12 v66.02,23.18 | C29.2 v21.25,43.5 | R6.1 v77.47,22.98 | R33.1 v20.95,51.55 | v33.66,15.9 R55.1 | R49.1 v51.96,82.87 | U9.1 U9.3 | U9.6 U9.7 v66.99,64.27 | U9.12 v71.44,64.27 | U9.2 v69.47,67.31 | C32.2 v62.24,65.72 v62.23,65.73 | C33.2 v62.23,63.5 | R57.2 v67.2,60.96 | R58.2 v67.2,59.69 | U6.5 61.42,82.89 U6.6 | U10.2 8.59,43.81 8.41,44 v8.41,44.13 | U4.2 v8.4,52.07 | C16.2 v8.86,47.31 | U2.2 v8.4,35.56 | R11.2 v1.56,42.86 | C7.2 v71.44,44.45 | R42.2 v83.07,36.2 | U5.1 v19.37,3.81 | R34.1 v67.2,57.78 | R35.1 v75.04,84.45 | R39.1 v75.04,87 | U7.14 v5.08,25.4 | U7.15 v5.08,24.13 | U7.8 v15.24,26.67 | U7.5 v15.24,22.86 | v9.84,29.84 9.53,29.53 U7.11 | Y2.2 78.37,35.24 v80.33,35.24
  Top 0.254: C5.1 v61.36,42.08
  Top 0.305: C2.- v55.13,46.99
  other vias: 60.33,48.26 58.74,47.94 57.47,47.94 57.15,46.35 57.47,44.45 59.05,44.77 60.64,44.45 62.23,46.35 66.04,48.1 75.56,35.88 75.56,34.29 65.89,43.18 86.04,27.3 61.59,81.92 62.87,81.92 61.59,79.38 62.23,80.64 62.87,79.38 61.59,75.56 24.13,33.66 53.66,30.16 53.66,18.1 82.87,24.45 36.83,53.98 31.75,49.21 60.96,9.53 60.64,23.18 11.43,63.82 9.84,62.55 20,59.69 47.62,41.59 67.94,41.91 75.25,43.18 71.44,38.1 62.23,32.38 41.27,13.34 37.78,46.04 58.74,5.71 77.15,47.94 86.04,53.02 10.16,60.64 1.91,1.91 3.81,1.91 5.71,1.91 7.62,1.91 9.53,1.91 11.43,1.91 13.34,1.91 15.24,1.91 17.14,1.91 19.05,1.91 34.29,1.91 20.95,1.91 22.86,1.91 26.67,1.91 28.57,1.91 30.48,1.91 32.38,1.91 36.2,1.91 38.1,1.91 40.01,1.91 41.91,1.91 43.81,1.91 45.72,1.91 47.62,1.91 49.53,1.91 51.44,1.91 53.34,1.91 55.24,1.91 57.15,1.91 59.05,1.91 60.96,1.91 62.87,1.91 64.77,1.91 66.67,1.91 68.58,1.91 70.48,1.91 72.39,1.91 74.3,1.91 76.2,1.91 78.11,1.91 80.01,1.91 81.92,1.91 83.82,1.91 85.72,1.91 87.63,1.91 89.22,1.91 89.22,3.81 89.22,5.71 89.22,7.62 89.22,9.53 89.22,11.43 89.22,13.34 89.22,41.27 89.22,43.18 89.22,45.09 89.22,56.52 89.22,58.42 89.22,60.33 89.22,62.23 89.22,64.14 89.22,66.04 89.22,67.94 89.22,69.85 89.22,71.75 89.22,73.66 89.22,75.56 89.22,77.47 89.22,79.38 89.22,81.28 89.22,83.19 89.22,85.09 89.22,87 89.22,88.9 87.95,89.22 86.04,89.22 84.14,89.22 82.23,89.22 80.33,89.22 78.42,89.22 76.52,89.22 74.61,89.22 72.71,89.22 70.8,89.22 68.9,89.22 66.99,89.22 65.09,89.22 63.18,89.22 61.28,89.22 59.37,89.22 57.47,89.22 55.56,89.22 53.66,89.22 51.75,89.22 49.85,89.22 47.94,89.22 46.04,89.22 44.13,89.22 42.23,89.22 40.32,89.22 38.42,89.22 36.51,89.22 34.61,89.22 32.7,89.22 30.8,89.22 29.53,89.22 21.59,85.41 19.68,85.41 17.78,85.41 15.88,85.41 13.97,85.41 12.7,85.72 11.75,86.68 11.43,87.95 11.43,89.22 9.84,89.22 7.94,89.22 6.03,89.22 4.13,89.22 2.22,89.22 1.59,87.31 1.59,85.41 1.59,83.5 1.59,81.6 1.59,79.69 1.59,77.79 1.59,75.88 1.59,73.98 1.59,72.07 1.59,70.17 1.59,68.26 1.59,66.36 1.91,3.81 1.91,5.71 1.91,7.62 1.91,9.53 1.91,11.43 1.91,13.34 1.91,15.24 1.91,17.14 1.91,19.05 1.91,20.95 1.91,22.86 1.91,24.77 1.91,26.67 1.91,28.57 1.91,30.48 1.91,32.38 1.91,38.73 1.91,40.64 1.91,46.99 1.91,48.9 1.91,55.24 42.55,78.74 35.88,72.07 25.72,69.53 9.84,79.69 27.94,82.55 11.75,83.5 28.26,21.27 28.26,27.62 25.08,30.8 34.61,33.34 39.05,13.65 44.13,13.65 46.04,34.61 25.72,12.38 65.09,19.37 66.99,14.92 70.8,12.38 73.98,23.18 82.87,14.29 78.42,4.76 60.96,16.83 83.5,44.45 76.2,60.33 75.56,68.9 78.42,82.87 52.07,86.36 38.42,80.33 59.37,68.26 44.13,56.83 51.44,45.09 65.41,37.78 69.53,31.11 63.82,30.16 61.28,26.35 74.3,26.35 27.62,9.21 8.89,24.77 67.31,66.99 19.68,8.89 12.7,54.61 17.78,46.35 17.78,49.85 17.78,52.39 12.7,38.1 12.7,46.35 14.61,38.1 14.61,46.35 14.61,54.61 79.38,55.12 85.09,55.12 72.07,47.31 57.47,24.45 23.5,85.41 25.4,85.41 27.3,85.41 29.53,87.95 28.57,86.04 29.21,87
  pour Top (isolate 0.203): 67.06,39.47 67.06,48.26 66.29,49.05 57.43,49.07 56.46,48.16 56.46,44.42 57.38,43.48 64.19,43.48 65.56,42.11 65.56,39.47
  pour Top (isolate 0.203): 73.15,32.38 76.45,32.36 76.72,32.62 79.26,32.65 80.34,33.73 80.34,37 79.68,37.66 76.89,37.66 76.15,36.92 76.15,34.24 75.84,33.93 73.15,33.93
  cutout GND: 18.41,33.18 21.75,36.51 26.67,36.51 28.57,38.42 28.57,43.18 30.48,43.18 30.48,37.62 27.46,34.61 22.54,34.61 20.32,32.38 20.32,13.97 26.04,8.26 26.04,-1.91 24.13,-1.91 24.13,7.62 18.41,13.34
  cutout GND: 30.48,47.15 28.57,47.15 28.57,52.4 28.27,52.7 20.64,52.7 16.19,57.15 0.64,57.15 0.64,59.05 16.51,59.05 20.95,54.61 29.21,54.61 30.48,53.34
  pour Bottom: 93.34,94.3 -3.17,94.3 -3.17,81.92 -3.17,-4.45 94.3,-4.45 94.3,94.3
  cutout Top: 26.04,-1.91 24.13,-1.91 24.13,7.62 18.41,13.34 18.41,33.18 21.75,36.51 26.67,36.51 28.57,38.42 28.57,51.44 27.3,52.7 20.64,52.7 16.19,57.15 0.64,57.15 0.64,59.05 16.51,59.05 20.95,54.61 27.94,54.61 30.48,52.07 30.48,38.1 30.48,37.62 27.46,34.61 22.54,34.61 20.32,32.38 20.32,13.97 26.04,8.26
  pour Top: -3.81,-4.13 95.25,-4.13 95.25,0.32 95.25,95.25 85.09,95.25 -3.81,95.25 -3.81,91.44
  pour GND: -1.27,91.76 92.39,91.76 92.39,-1.59 -1.27,-1.59
  cutout Bottom: 24.13,-1.91 24.13,7.62 18.41,13.34 18.41,33.18 21.75,36.51 26.67,36.51 28.57,38.42 28.57,51.44 27.3,52.7 20.64,52.7 16.19,57.15 0.64,57.15 0.64,59.05 16.51,59.05 20.95,54.61 27.94,54.61 30.48,52.07 30.48,37.62 27.46,34.61 22.54,34.61 20.32,32.38 20.32,13.97 26.04,8.26 26.04,-1.91
HMC1053_RESET  (via drill 0.35)
  Top 0.203: v34.92,49.53 37.06,49.53 37.16,49.43 37.77,49.43 38.2,49.86 68.02,49.86 69.64,48.24 69.64,44.13 69.64,43.68 71.56,41.76 71.56,41.31 U1.2 | v18.1,35.88 TP1.1 18.1,8.89 17.82,8.61 U5.4 16.83,7.62 16.51,7.3 16.51,5.4 16.83,5.08 U5.2
  Bottom 0.203: v34.92,49.53 32.07,46.67 29.53,46.67 27.94,45.09 27.94,40.64 27.3,40.01 21.59,40.01 18.1,36.51 v18.1,35.88
MAG_X_FIN
  Top 0.203: U1.24 59.72,36.91 56.68,33.87 56.68,33.86 55.07,32.25 55.07,23.09 55.27,22.89 55.27,12.56 53.07,10.37 38.59,10.37 37.75,9.53 JP2A.8
MAG_X_RIN
  Top 0.203: U1.23 59.69,37.41 54.74,32.45 54.74,22.95 54.94,22.75 54.94,12.7 52.94,10.7 36.92,10.7 35.75,9.53 JP2A.6
MAG_Y_FIN
  Top 0.203: U1.26 59.65,35.91 57.34,33.6 57.34,33.59 55.73,31.98 55.73,23.36 55.93,23.16 55.93,12.16 53.48,9.71 40.82,9.71 40.64,9.53 40.64,8.1 JP2A.12
MAG_Y_RIN
  Top 0.203: U1.25 59.68,36.41 57.01,33.73 57.01,33.72 55.4,32.11 55.4,23.22 55.6,23.02 55.6,12.29 53.34,10.04 40.26,10.04 39.75,9.53 JP2A.10
MAG_Z_FIN
  Top 0.203: U1.30 58.59,33.91 58,33.32 58,33.31 56.39,31.7 56.39,23.63 56.59,23.43 56.59,11.88 53.75,9.05 49.78,9.05 JP2B.4
MAG_Z_RIN
  Top 0.203: U1.29 58.62,34.41 57.67,33.46 57.67,33.45 56.06,31.84 56.06,23.5 56.26,23.3 56.26,12.02 53.62,9.38 48.11,9.38 JP2B.2
MSP430_ACTIVE  (via drill 0.35)
  Top 0.203: v34.29,50.83 34.29,50.8 37.06,50.8 37.16,50.9 37.77,50.9 38.48,50.19 68.16,50.19 69.97,48.38 69.97,43.81 72.06,41.73 U1.1 | v32.38,50.8 31.11,52.07 31.11,53.02 29.17,54.97 20.51,54.97 16.18,59.3 9.77,59.3 v8.89,58.42
  Bottom 0.203: v34.29,50.83 34.26,50.8 v32.38,50.8 | v8.89,69.22 13.34,64.77 13.34,59.69 12.7,59.05 9.53,59.05 v8.89,58.42
MSP_OBC_RESET
  Top 0.203: R36.2 73.97,51.65 Q1.1 73.97,49.53 73.03,48.58 71.18,48.58 68.58,51.18 44.23,51.18 38.04,57.37 25.01,57.37 23.21,59.17 21.71,59.17 17.26,63.62 16.23,63.62 16.22,63.62 13.83,63.62 9.09,68.36 4.45,68.36 3.17,67.09 3.17,64.48 J3.5
N$1  (via drill 0.35)
  Top 0.203: R55.2 v33.66,12.06
  Bottom 0.203: JP2A.4 33.75,11.97 v33.66,12.06
N$3  (via drill 0.35)
  other vias: 37.47,50.16
N$7
  Top 0.203: U6.4 61.98,83.25 61.66,83.57 60.89,83.57 60.64,83.82 R30.1
N$8  (via drill 0.35)
  other vias: 76.83,32.38
N$9
  Top 0.203: C18.1 9.53,12.7 TP6.1 12.66,9.56 U5.5
N$10  (via drill 0.35)
  other vias: 66.67,75.56
N$11  (via drill 0.35)
  other vias: 66.67,73.98
N$12  (via drill 0.35)
  other vias: 66.67,72.39
N$13
  Top 0.203: C24.2 57.16,83.83 59.6,81.39 U6.9
N$14
  Top 0.203: U6.27 68.28,81.89 69.05,81.13 Y3.P1 69.12,79.92
  Top 0.254: 69.12,79.92 70.48,78.56 C26.2
N$15
  Top 0.203: U6.26 67.51,81.39 68.11,80.8 Y3.P2
  Top 0.254: C27.2 66.67,78.56 Y3.P2
N$16
  Top 0.203: U6.7 59.68,82.39 58.32,83.75 58.32,85.62 60.15,87.45 62.47,87.45 63.46,86.46 68.8,86.46 70.64,84.61 J2.1 R35.2
N$17
  Top 0.203: U6.8 59.71,81.89 57.99,83.62 57.99,85.76 60.01,87.78 62.6,87.78 63.39,87 J2.2 R39.2
N$18
  Top 0.203: R58.1 69.97,60.58 U9.11
N$19
  Top 0.203: U9.10 69.47,61.84 69.08,61.46 R57.1
N$20
  Top 0.203: R11.1 R10.2 R14.1
N$21
  Top 0.203: R15.2 C17.1 14.61,44.23 14.61,43.71 R13.1 U10.4
N$22  (via drill 0.35)
  other vias: 68.58,71.75
N$23
  Top 0.203: R14.2 R12.1 U10.3
N$24  (via drill 0.35)
  other vias: 70.48,72.39
N$25  (via drill 0.35)
  other vias: 70.17,74.3
N$26  (via drill 0.35)
  other vias: 70.48,75.56
N$27  (via drill 0.35)
  other vias: 66.67,80.33
N$28  (via drill 0.35)
  other vias: 70.17,80.01
N$29
  Top 0.203: U3.2 25.08,46.67 24.77,46.99 TP5.1 22.75,46.99 20.95,48.78 R33.2
N$30  (via drill 0.35)
  Top 0.203: U3.13 v33.97,45.4 | R38.2 v34.61,42.55
  Bottom 0.203: v34.61,42.55 33.97,43.18 v33.97,45.4
N$31
  Top 0.203: U3.7 C29.1 23.23,42.7 21.74,42.7 21.27,42.23 R37.2
N$32
  Top 0.203: J1.2 R42.1
N$33
  Top 0.203: J1.10 87,14.61 R43.1
N$34
  Top 0.203: U1.67 75.95,31.91 76.2,31.65 77.14,31.65 77.24,31.75 R46.1
N$35
  Top 0.203: C18.2 TP8.1 R16.1
N$36
  Top 0.203: U7.2 9.53,22.69 12.23,25.4 U7.7 13.97,25.4 14.61,25.4 15.01,25.4 15.97,26.37 15.97,27.66 15.06,28.57 R19.2
N$37
  Top 0.203: R16.2 9.53,16.51 10.79,17.78 TP7.1 U7.3 10.79,23.5 11.43,24.13 U7.6
N$38
  Top 0.203: U1.66 75.56,31.41 75.71,31.26 77.33,31.26 78.11,30.48 R47.1
N$39
  Top 0.203: C10.2 20.74,6.88 R9.1 19.72,6.99 19.09,6.35 U5.3
N$40
  Top 0.203: U6.1 63.79,83.5 63.82,83.5 66.04,85.72 R48.2
N$42
  Top 0.203: R49.2 55.79,82.87 58.76,79.89 U6.12
N$43
  Top 0.203: U6.13 58.13,79.39 55.92,81.6 R50.2
N$44
  Top 0.203: R51.2 61.59,74.16 64.76,77.32 64.76,78.73 64.59,78.89 U6.21
N$45
  Top 0.203: U6.22 64.56,79.39 65.09,78.86 65.09,77.15 62.87,74.93 R52.2
N$46
  Top 0.203: R53.2 64.14,75.56 65.42,76.85 65.42,79 64.52,79.89 U6.23
N$47
  Top 0.203: R54.2 65.41,76.37 65.75,76.71 65.75,79.14 64.49,80.39 U6.24
N$48
  Top 0.203: U5.7 U5.6
N$49
  Top 0.203: R18.1 R17.2 R22.1
N$50
  Top 0.203: R23.2 C21.1 14.61,35.98 14.61,35.46 R21.1 U2.4
N$52
  Top 0.203: R22.2 R20.1 U2.3
N$58
  Top 0.203: JP1.6 87.26,69.34 R45.1
N$59
  Top 0.203: R25.1 R24.2 R28.1
N$60
  Top 0.203: R29.2 C23.1 14.61,52.49 14.61,51.97 R27.1 U4.4
N$62
  Top 0.203: U4.3 R26.1 R28.2
OUT_A_N  (via drill 0.35)
  Top 0.203: TP13.1 7.41,41.27 R12.2 | U7.10 10.79,30.35 10.38,30.77 v10.38,31.41
  Bottom 0.203: v10.38,31.41 10.64,31.66 10.64,40.8 10.16,41.27 TP13.1
OUT_A_P  (via drill 0.35)
  Top 0.203: TP12.1 14.92,41.27 15.46,41.81 R13.2 | v11.75,31.11 11.75,30.48 11.43,30.16 11.43,25.08 9.21,22.86 U7.16
  Bottom 0.203: TP12.1 11.43,41.27 10.97,40.81 10.97,32.38 11.75,31.6 v11.75,31.11
OUT_B_N  (via drill 0.35)
  Top 0.203: U7.4 12.06,22.86 v11.75,23.18 | R20.2 5.82,33.55 6.35,33.02 TP15.1
  Bottom 0.203: TP15.1 8.89,26.04 v11.75,23.18
OUT_B_P
  Top 0.203: R21.2 15.46,33.66 14.82,33.02 TP14.1 10.79,33.02 8.26,30.48 U7.12
OUT_C_N  (via drill 0.35)
  Top 0.203: R26.2 5.82,50.06 6.35,49.53 TP17.1 | U7.9 12.7,28.04 13.34,28.68 v13.34,29.21
  Bottom 0.203: TP17.1 9.84,49.53 10.44,48.93 10.44,46.99 13.61,43.81 13.61,38.65 13.52,38.55 13.52,37.65 13.61,37.55 13.61,30.12 13.34,29.84 v13.34,29.21
OUT_C_P  (via drill 0.35)
  Top 0.203: TP16.1 14.61,49.53 15.46,50.38 R27.2 | v10.48,26.35 8.89,26.35 8.57,26.67 U7.13
  Bottom 0.203: TP16.1 11.43,49.53 10.79,48.9 10.79,47.14 13.97,43.96 13.97,38.5 13.87,38.4 13.87,37.8 13.97,37.7 13.97,29.61 14.07,29.51 14.07,28.91 11.52,26.35 v10.48,26.35
P1.7/CTS  (via drill 0.35)
  Top 0.203: U1.28 61.62,34.91 v61.91,34.61 | J1.5 86.28,28.57 85.53,27.83 74.81,27.83 74.68,27.96 72.12,27.96 70.87,29.21 v66.99,29.21
  Bottom 0.203: v61.91,34.61 61.91,34.29 v66.99,29.21
P4.4/UCA1TXD
  Top 0.203: U1.51 67.56,25.23 68.07,24.72 68.07,21.59 69.34,20.32 76.43,20.32 79.61,23.5 J1.7
P4.5/UCA1RXD
  Top 0.203: U1.52 68.06,25.2 68.4,24.86 68.4,21.77 69.52,20.65 76.3,20.65 81.68,26.04 J1.6
P5.2/XT2IN1
  Top 0.203: Y2.3 76.82,33.67 76.06,32.91 U1.69
P5.3/XT2OUT1
  Top 0.203: Y2.1 76.92,36.67 76.68,36.42 76.68,34.24 75.84,33.4 U1.70
P5.4/XIN1
  Top 0.203: C3.2 63.75,48.08 Y1.P2 65.72,46.83 66.12,46.43 66.12,43.94 66.56,43.5 U1.12
P5.5/XOUT1
  Top 0.203: C4.2 63.76,44.64 Y1.P1 65.2,45.69 65.2,42.77 66.06,41.91 U1.13
P6.7/RTS  (via drill 0.35)
  Top 0.203: v71.66,31.76 71.66,28.89 72.26,28.29 74.81,28.29 74.94,28.16 85.31,28.16 J1.4 | U1.4 70.56,38.1 70.48,38.02 v70.48,36.83
  Bottom 0.203: v70.48,36.83 70.48,36.52 71.66,35.34 v71.66,31.76
RESERVED_1  (via drill 0.35)
  Top 0.203: U1.35 59.69,31.41 58.77,30.48 v57.78,30.48 | v50.8,43.18 49.21,43.18 43.71,48.69 34.4,48.69 33.56,49.53 33.56,51.52 29.44,55.63 20.78,55.63 16.45,59.96 11.96,59.96 10.33,61.59 8.06,61.59 J3.6
  Bottom 0.203: v50.8,43.18 52.55,41.42 52.55,40.63 53.31,39.87 53.31,38.82 55.24,36.89 55.24,33.02 v57.78,30.48
RESERVED_2  (via drill 0.35)
  Top 0.203: U1.36 59.69,30.91 58.19,29.4 58.19,28.98 v57.78,28.57 | v50.85,41.01 43.51,48.36 34.26,48.36 33.23,49.39 33.23,51.38 29.31,55.3 20.65,55.3 16.31,59.63 9.58,59.63 8.86,60.36 J3.8
  Bottom 0.203: v57.78,28.57 54.91,31.45 54.91,36.75 52.98,38.68 52.98,39.73 51.71,41.01 v50.85,41.01
RST/SBWTDIO
  Top 0.203: S1.2 S1.1 75.2,3.45 84.61,12.87 84.61,19.21 86.36,20.95 J1.8 89.38,22.07 89.38,31.57 88.57,32.38 85.72,32.38 81.92,36.2 80.12,37.99 76.51,37.99 74.93,36.41 73.98,36.41 73.93,36.45 73.89,36.45 U1.76 73.28,36.41 73.01,36.68 73.01,38.63 73.07,38.69 73.67,39.3 C7.1 73.53,44.6 R7.1 73.53,47.06 Q1.3
RW_X_DIR  (via drill 0.35)
  Top 0.203: U1.53 68.56,25.17 68.73,25 68.73,23.66 69.85,22.54 v69.85,21.91
  Bottom 0.203: v69.85,21.91 56.2,8.26 45.09,8.26 44.45,7.62 44.45,4.42 44.89,3.98 46.71,3.98 JP2B.3
RW_X_LOCK  (via drill 0.35)
  Top 0.203: U1.21 54.97,38.41 54.29,37.73 43.64,37.73 35.44,29.53 35.44,10.6 v35.56,10.48
  Bottom 0.203: JP2A.11 42.76,5.99 42.76,7.4 42.55,7.61 42.55,7.62 42.54,7.62 42.17,7.99 38.73,7.99 38.36,7.99 38.05,7.99 v35.56,10.48
RW_X_SPEED_CTRL
  Top 0.203: U1.42 63.06,26 62.31,25.26 62.31,20.95 65.41,17.86 65.41,7.3 60.96,2.86 53.02,2.86 52.39,2.22 51.75,2.86 41.88,2.86 JP2A.9
RW_Y_DIR  (via drill 0.35)
  Top 0.203: U1.54 69.11,26.98 69.11,24.55 v69.85,23.81
  Bottom 0.203: v69.85,23.81 67.31,21.27 67.31,20.02 56.03,8.74 55.88,8.59 44.95,8.59 44.12,7.76 44.12,4.28 44.75,3.65 48.38,3.65 JP2B.5
RW_Y_LOCK  (via drill 0.35)
  Top 0.203: 54.61,37.4 43.77,37.4 35.77,29.39 35.77,14.4 38.73,11.43 v43.18,11.43 | 54.61,37.4 | 54.61,37.4 54.75,37.4 55.25,37.91 U1.22 | v42.55,8.89 43.81,7.62 43.81,4.45 45.07,3.19 52.06,3.19 52.39,2.86 52.55,2.86 53.72,4.03 JP2B.9
  Bottom 0.203: v43.18,11.43 43.18,9.53 v42.55,8.89
RW_Y_SPEED_CTRL  (via drill 0.35)
  Top 0.203: U1.33 59.16,32.41 59.04,32.29 57.78,32.29 57.73,32.23 57.72,32.23 56.72,31.24 56.72,23.77 56.92,23.57 56.92,16.51 57.32,16.11 v57.32,15.88
  Bottom 0.203: v57.32,15.88 55.8,14.36 55.8,12.06 53.27,9.53 45.09,9.53 43.51,7.95 43.51,4.26 44.59,3.17 49.91,3.17 JP2B.7
RW_Z_DIR  (via drill 0.35)
  Top 0.203: v70.8,22.86 70.8,23.7 70.7,23.8 70.7,24.13 69.56,25.27 U1.55 | v64.14,10.16 64.14,7.62 v63.5,6.99
  Bottom 0.203: v64.14,10.16 70.8,16.83 v70.8,22.86 | JP2A.3 35.88,2.86 44.44,2.86 44.46,2.85 50.05,2.85 50.06,2.86 59.37,2.86 v63.5,6.99
RW_Z_LOCK
  Top 0.203: U1.27 61.34,35.41 61.61,35.68 61.61,38.67 61.43,38.86 54.77,38.86 53.98,38.06 43.5,38.06 35.11,29.66 35.11,11.64 34.29,10.82 30.21,10.82 29.18,9.8 29.18,5.11 30.48,3.81 36.58,3.81 JP2A.7
RW_Z_SPEED_CTRL  (via drill 0.35)
  Top 0.203: U1.34 57.86,31.91 57.78,31.83 57.05,31.1 57.05,27.4 v57.78,26.67
  Bottom 0.203: v57.78,26.67 59.05,25.4 59.05,21.45 55.47,17.87 55.47,12.2 53.86,10.58 45.51,10.58 43.18,8.26 43.18,4.99 42,3.81 36.92,3.81 JP2A.5
TARGET_PUR  (via drill 0.35)
  Top 0.203: v76.2,29.84 76.14,29.91 U1.63 | v77.47,27.09 R6.2
  Bottom 0.203: v76.2,29.84 77.47,28.57 v77.47,27.09
TEST/SBWTCK  (via drill 0.35)
  Top 0.203: U1.71 72.96,33.91 v72.39,33.34
  Bottom 0.203: J1.9 80.01,18.41 72.39,26.04 v72.39,33.34
UCA0RXD
  Top 0.203: U1.41 62.56,27.94 63.2,28.57 64.37,28.57 72.68,36.89 72.68,38.77 72.84,38.93 72.84,42.01 70.64,44.22 70.64,48.65 68.43,50.85 44.09,50.85 37.99,56.95 21.39,56.95 18.08,60.26 18.08,61.29 J4.2 16.08,63.29 13.69,63.29 9.04,67.94 6.89,67.94 J3.1
UCA0TXD  (via drill 0.35)
  Top 0.203: U1.40 64.23,28.91 72.35,37.02 72.35,38.91 72.51,39.07 72.51,41.87 70.3,44.08 70.3,48.51 68.3,50.52 43.95,50.52 37.85,56.62 21.25,56.62 15.64,62.23 J4.1 14.29,62.23 11.59,64.93 10.64,64.93 v10.16,65.41
  Bottom 0.203: v10.16,65.41 7.62,67.94 3.81,67.94 3.17,67.31 3.17,66.48 J3.3
UCB0_SPI_CLK  (via drill 0.35)
  Top 0.203: U3.16 43.2,47.31 50.66,39.85 61.84,39.85 62.6,39.08 62.6,37.79 64.16,36.24 64.16,35.56 64.45,35.27 64.45,35.24 v65.41,35.24 65.41,33.22 61.59,29.41 U1.39 59.7,29.41 59.18,28.88 59.18,15.12 v59.69,14.61 | JP2B.6 51.45,8.72 53.89,8.72 56.92,11.75 56.92,12.32 v57.32,12.72
  Bottom 0.203: v65.41,35.24 66.36,35.24 67.31,36.2 67.31,37.04 69.76,39.49 73.88,39.49 76.25,41.86 76.25,43.23 77.99,44.97 77.99,47.1 J8.2 80.97,50.08 80.97,64.91 JP1.7 | v59.69,14.61 59.69,13.97 58.42,12.7 57.34,12.7 v57.32,12.72
UCB0_SPI_MISO  (via drill 0.35)
  Top 0.203: v48.26,40.01 48.75,39.52 61.7,39.52 62.27,38.95 62.27,37.66 63.83,36.1 63.83,35.4 64.45,34.78 v64.45,33.34 64.45,32.76 61.59,29.91 U1.38 59.69,29.91 58.85,29.06 58.85,12.11 JP2B.10 | v45.72,40.64 42.23,44.13 33.74,44.13 33.1,44.77 U3.12
  Bottom 0.203: v48.26,40.01 47.62,40.64 v45.72,40.64 | v64.45,33.34 64.92,33.34 65.41,33.82 65.87,33.82 67.97,35.92 67.97,36.77 70.03,38.83 74.24,38.83 76.2,40.79 77.68,40.79 J8.5 81.64,44.74 81.64,61.57 JP1.11
UCB0_SPI_MOSI  (via drill 0.35)
  Top 0.203: U3.14 33.57,46.04 33.67,46.14 34.28,46.14 34.87,45.54 37.24,45.54 37.48,45.3 38.09,45.3 38.33,45.54 42.72,45.54 46.89,41.37 46.89,40.34 48.04,39.19 61.56,39.19 61.94,38.81 61.94,37.52 63.5,35.96 v63.5,34.29 63.5,32.31 61.59,30.41 U1.37 59.69,30.41 58.52,29.23 58.52,12.88 54.02,8.39 52.84,8.39 51.72,7.27 JP2B.8
  Bottom 0.203: v63.5,34.29 65.87,34.29 67.64,36.06 67.64,36.91 69.9,39.16 74.02,39.16 78.37,43.52 78.37,43.53 79.32,44.48 J8.4 81.31,46.41 81.31,47.31 81.31,63.27 83.37,65.34 JP1.9
UCB1_I2C_SCL  (via drill 0.35)
  Top 0.203: U6.19 62.98,77.73 62.73,77.48 61.28,77.48 56.52,72.72 TP18.1 58.31,60.64 58.84,60.11 61.05,60.11 61.81,60.87 R60.1 62.77,60.96 64.77,58.96 70.39,58.96 72.17,60.74 72.17,64.57 71.74,65 71.13,65 70.9,64.77 U9.13 | U1.47 65.56,25.55 v64.14,24.13
  Bottom 0.203: v64.14,24.13 61.76,24.13 59.48,26.42 59.48,28.86 58.52,29.82 58.52,30.78 55.58,33.73 55.58,37.02 53.65,38.95 53.65,40.01 52.89,40.76 52.89,49.29 53.29,49.7 53.29,54.12 56.52,57.35 TP18.1
UCB1_I2C_SDA  (via drill 0.35)
  Top 0.203: U1.46 65.06,26.32 v64.45,25.72 | U6.20 63.79,77.44 63.18,76.83 61.59,76.83 60.01,75.25 60.01,70.48 62.13,68.36 69.45,68.36 70.4,67.41 70.4,65.66 70.33,65.58 U9.14 70.8,65.27 70.87,65.33 71.88,65.33 72.5,64.71 72.5,60.6 70.52,58.63 62.02,58.63 R59.1 60.86,59.37 58.1,59.37 TP19.1
  Bottom 0.203: v64.45,25.72 63.5,24.77 61.59,24.77 59.81,26.55 59.81,29 58.85,29.95 58.85,30.92 55.91,33.86 55.91,37.16 53.98,39.09 53.98,40.14 53.22,40.9 53.22,49.16 53.62,49.56 53.62,53.98 57.47,57.83 TP19.1
VCORE1
  Top 0.254: U1.20 62.23,40.28
  Top 0.305: C6.2 61.44,40.79 61.95,40.28 62.23,40.28
Z-_SUN_3V_PRESENT  (via drill 0.35)
  Top 0.203: v44.77,79.69 41.84,79.69 39.63,77.48 21.94,77.48 20.93,76.47 20.93,72.36 20.1,71.54 3.52,71.54 2.66,70.68 2.66,66.17 1.27,64.77 1.27,59.69 2.6,58.36 J3.9 | JP1.4 86.68,72.61 86.68,74.3 78.84,82.13 78.12,82.13 77.6,82.65 v69.85,82.65
  Bottom 0.203: v44.77,79.69 46.67,79.69 47.62,80.64 57.32,80.64 60.07,83.4 62.89,83.4 64.04,82.25 69.55,82.25 69.85,82.55 v69.85,82.65

## Text on the board
tPlace: ADCS MOTHERBOARD REV B | Designer: Thomas Christison | +3V3 | Dalhousie Space Systems Lab | +5V | POWER | GND | +3V3 | +5V | * | TX | RX | GND | 3V3 | +Y | RTS>> | +X | CTS<< | RXD<< | TXD>> | SBWRST | SBWTST